# EAGLE design KeyCade (EAGLE 7.7.0)
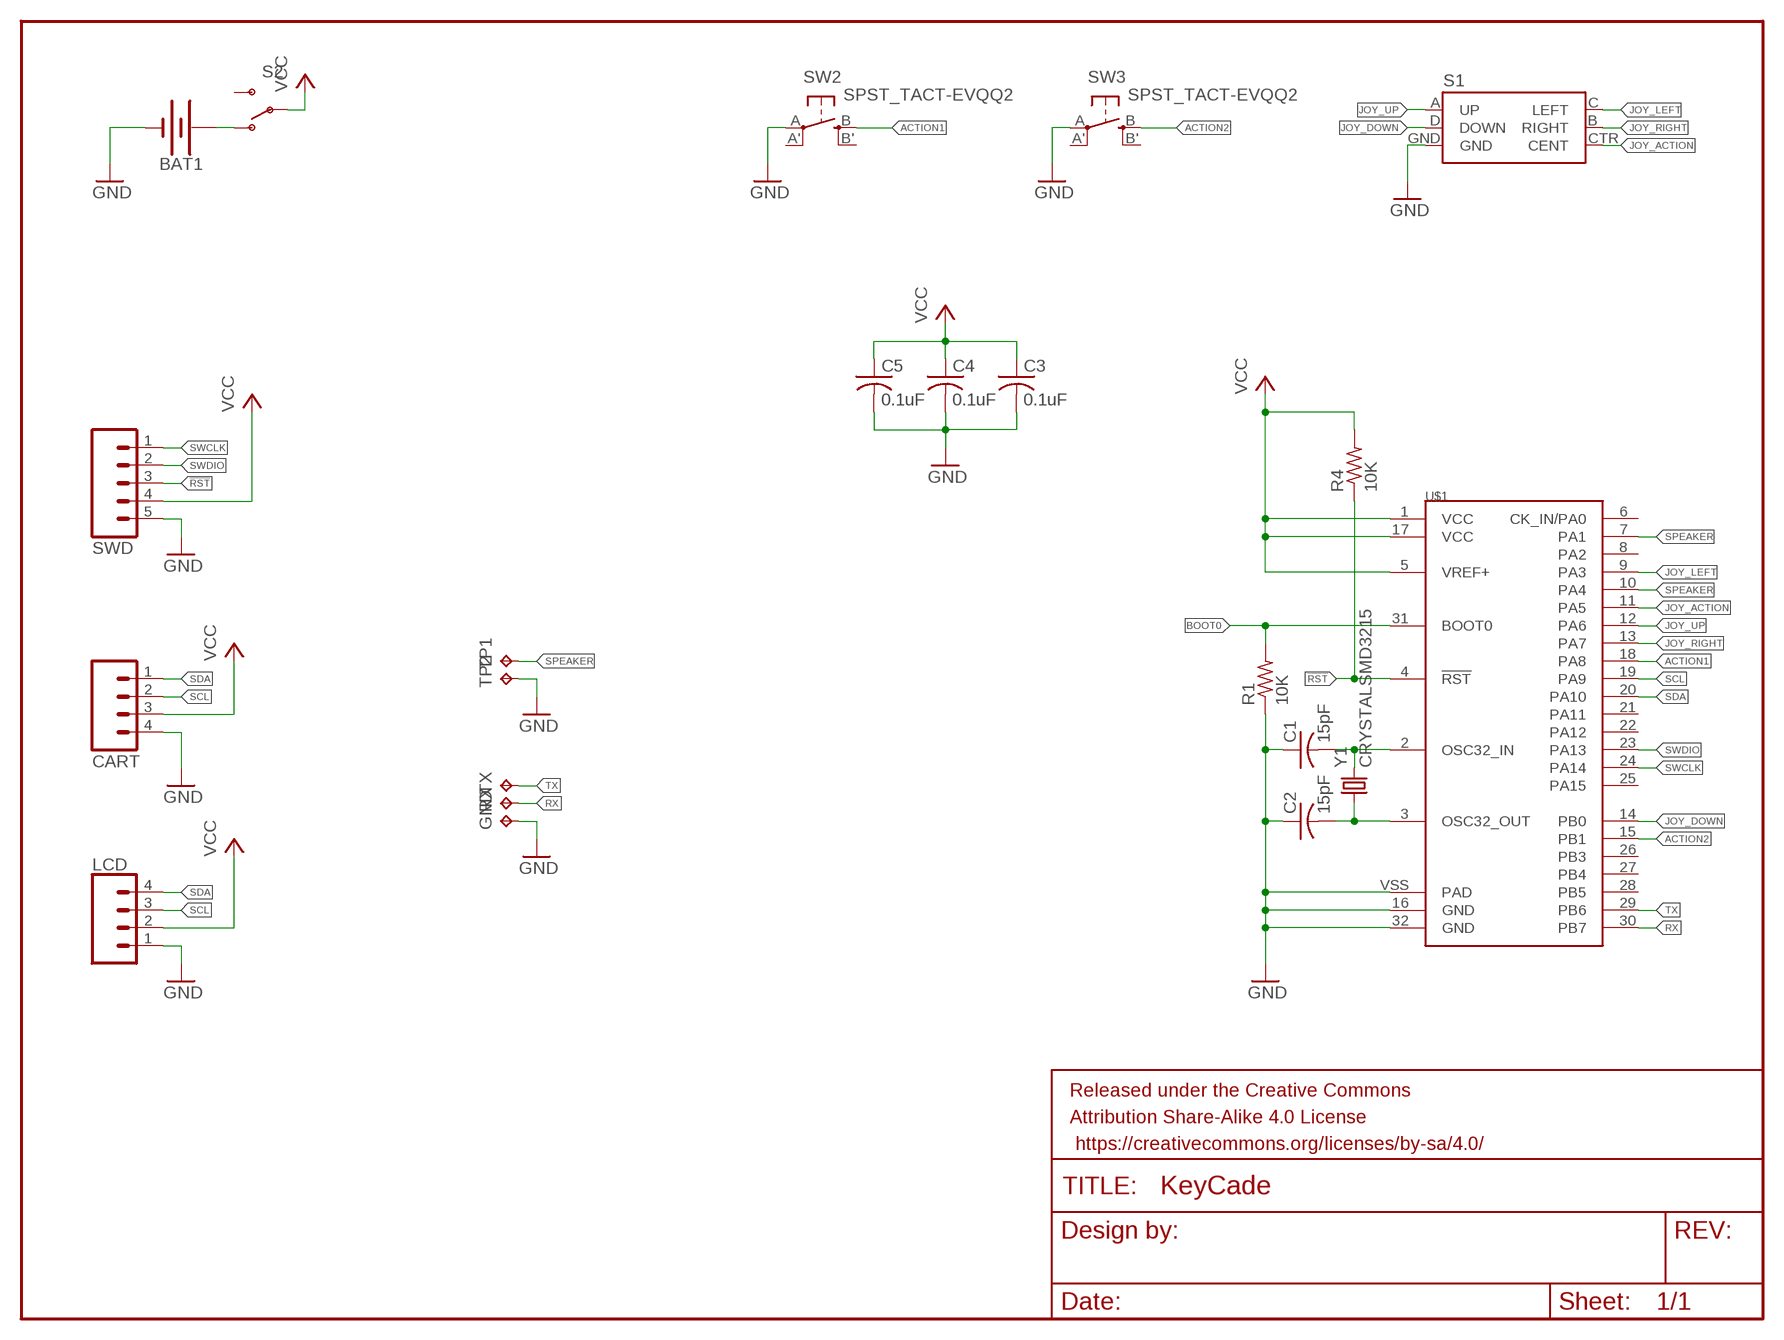
[diagram p0: schematic, sheet 1]

## Parts
BAT1  BATTERY-20MM_SMD_4LEGS  [BATTCON_20MM_4LEGS]
C1  15pF  C-USC0603  [C0603]
C2  15pF  C-USC0603  [C0603]
C3  0.1uF  C-USC0603  [C0603]
C4  0.1uF  C-USC0603  [C0603]
C5  0.1uF  C-USC0603  [C0603]
CART  M04PTH  [1X04@1]
FRAME1  FRAME-LETTER  [CREATIVE_COMMONS]
GND  TPTP17SQ  [TP17SQ]
LCD  CONN_04SMD_RA_FEMALE  [1X04_SMD_RA_FEMALE]
R1  10K  R-US_R0603  [R0603]
R4  10K  R-US_R0603  [R0603]
RX  TPTP17SQ  [TP17SQ]
S1  JOYSTICK_MINI  [JOYSTICK_MINI]
S2  SWITCH-SPDT-SMD-A  [SWITCH-SPST-SMD-A]
SW2  SPST_TACT-EVQQ2  [EVQ-Q2]
SW3  SPST_TACT-EVQQ2  [EVQ-Q2]
SWD  M05PTH  [1X05]
TP1  TPTP17SQ  [TP17SQ]
TP2  TPTP17SQ  [TP17SQ]
TX  TPTP17SQ  [TP17SQ]
U$1  STM32L432KCIC  [UFQFPN32]
Y1  CRYSTALSMD3215  [ST3215SB_32X15]

## Nets
!RST: R4.1 SWD.3 U$1.4(!RST)
+3V: BAT1.POSITIVE@1(+) BAT1.POSITIVE@2(+) BAT1.POSITIVE@3(+) BAT1.POSITIVE@4(+) S2.1(O)
ACTION1: SW2.B(S) U$1.18(PA8)
ACTION2: SW3.B(S) U$1.15(PB1)
BOOT0: R1.2 U$1.31(BOOT0)
GND: BAT1.NEGATIVE(-) C1.1 C2.1 C3.2 C4.2 C5.2 CART.4 GND.TP LCD.1 R1.1 S1.GND SW2.A(P) SW3.A(P) SWD.5 TP2.TP U$1.16(GND) U$1.32(GND) U$1.VSS(PAD)
JOY_ACTION: S1.CTR(CENT) U$1.11(PA5)
JOY_DOWN: S1.D(DOWN) U$1.14(PB0)
JOY_LEFT: S1.C(LEFT) U$1.9(PA3)
JOY_RIGHT: S1.B(RIGHT) U$1.13(PA7)
JOY_UP: S1.A(UP) U$1.12(PA6)
OSC32_IN: C1.2 U$1.2(OSC32_IN) Y1.2
OSC32_OUT: C2.2 U$1.3(OSC32_OUT) Y1.1
RX: RX.TP U$1.30(PB7)
SCL: CART.2 LCD.3 U$1.19(PA9)
SDA: CART.1 LCD.4 U$1.20(PA10)
SPEAKER: TP1.TP U$1.7(PA1) U$1.10(PA4)
SWCLK: SWD.1 U$1.24(PA14)
SWDIO: SWD.2 U$1.23(PA13)
TX: TX.TP U$1.29(PB6)
VCC: C3.1 C4.1 C5.1 CART.3 LCD.2 R4.2 S2.2(P) SWD.4 U$1.1(VCC) U$1.5(VREF+) U$1.17(VCC)
Unconnected: S2.3(S) SW2.A'(P1) SW2.B'(S1) SW3.A'(P1) SW3.B'(S1) U$1.6(CK_IN/PA0) U$1.8(PA2) U$1.21(PA11) U$1.22(PA12) U$1.25(PA15) U$1.26(PB3) U$1.27(PB4) U$1.28(PB5)

## Library data of the parts
BAT1 = SparkFun-Batteries:BATTERY: Battery - Single Cell A variety of battery chemistries, sizes, and footprints. Device List: 20MM_PTH - Coin Cell Battery Holder - 20mm (PTH) <https://www.sparkfun.com/products/783> 12MM_SMD - Coin Cell Battery Holder - 12mm (SMD) <https://www.sparkfun.com/products/10592> 12MM_PTH - Coin Cell Battery Holder - 12mm (PTH) <https://www.sparkfun.com/products/7948> 20MM_SMD - 20mm Coin Cell Battery Holder (SMD) (2 legs) Used on the Big Time Watch Kit <https://www.sparkfun.com/products/11734> 20MM_SMD_4LEGS - Coin Cell Battery Holder - 20mm (SMD) <https://www.sparkfun.com/products/11892> 20MM_SMD_4LEGS_OVERPASTE - Coin Cell Battery Holder - 20mm (SMD) <https://www.sparkfun.com/products/11892> (Over-paste on the legs) 24.5MM_PTH - Coin Cell Battery Holder - 24.5mm (PTH) <https://www.sparkfun.com/products/8863> 9V - 9V Battery Holder - PC Mount Used on the SparkFun SparkPunk Sound Kit <https://www.sparkfun.com/products/11177> and SparkFun SparkPunk Sequencer Kit <https://www.sparkfun.com/products/12707> 18650 - Battery Holder - 18650 (PTH) <https://www.sparkfun.com/products/13113> AA - Battery Holder - 1xAA (PTH) <https://www.sparkfun.com/products/7949> AAA - Battery Holder - 1xAAA (PTH) <https://www.sparkfun.com/products/12718> AA_KIT - Battery Holder - 1xAA (PTH) <https://www.sparkfun.com/products/7949> Special kit package - pads only have exposed copper on one side of the board. AAA_KIT - Battery Holder - 1xAAA (PTH) <https://www.sparkfun.com/products/12718> Special kit package - pads only have exposed copper on one side of the board.; PROD_ID: BATT-10373; SF_SKU: PRT-11892
C1-C5 = adafruit:C-US: CAPACITOR, American symbol
CART = SparkFun-Connectors:M04: Header 4 Standard 4-pin 0.1" header. Use with straight break away headers (SKU : PRT-00116), right angle break away headers (PRT-00553), swiss pins (PRT-00743), machine pins (PRT-00117), and female headers (PRT-00115). Molex polarized connector foot print use with SKU : PRT-08231 with associated crimp pins and housings. 1MM SMD Version SKU: PRT-10208
FRAME1 = StuffLabs:FRAME-LETTER: Schematic Frame Standard 8.5x11 US Letter frame
GND RX TP1 TP2 TX = testpad:TP: Test pad
LCD = SparkFun-Connectors:CONN_04: Multi connection point. Often used as Generic Header-pin footprint for 0.1 inch spaced/style header connections On any of the 0.1 inch spaced packages, you can populate with these: Break Away Headers - Straight <https://www.sparkfun.com/products/116> (PRT-00116) Break Away Male Headers - Right Angle <https://www.sparkfun.com/products/553> (PRT-00553) Female Headers <https://www.sparkfun.com/products/115> (PRT-00115) Break Away Headers - Machine Pin <https://www.sparkfun.com/products/117> (PRT-00117) Break Away Female Headers - Swiss Machine Pin <https://www.sparkfun.com/products/743> (PRT-00743) For SCREWTERMINALS and SPRING TERMINALS visit here: Screw Terimnals on SparkFun.com <https://www.sparkfun.com/search/results?term=Screw+Terminals> (5mm/3.5mm/2.54mm spacing) This device is also useful as a general connection point to wire up your design to another part of your project. Our various solder wires solder well into these plated through hole pads. Hook-Up Wire - Assortment (Stranded, 22 AWG) <https://www.sparkfun.com/products/11375> (PRT-11375) Hook-Up Wire - Assortment (Solid Core, 22 AWG) <https://www.sparkfun.com/products/11367> (PRT-11367) View the entire wire category on our website here <https://www.sparkfun.com/categories/141> Special notes: Molex polarized connector foot print use with SKU : PRT-08231 with associated crimp pins and housings. 1MM SMD Version SKU: PRT-10208
R1 R4 = adafruit:R-US_: RESISTOR, American symbol
S1 = SparkFun-Electromechanical:JOYSTICK_MINI: Small 5-way tactile joystick, COM-10063 4UCON SF303GJ26; PROD_ID: SWCH-09905
S2 = SparkFun-Electromechanical:SWITCH-SPDT: SPDT Switch Simple slide switch, Spark Fun Electronics SKU : COM-00102 DPDT SMT slide switch, AYZ0202, SWCH-08179
SW2 SW3 = adafruit:SPST_TACT: SMT 6mm switch, EVQQ2 series http://www.ladyada.net/library/eagle
SWD = SparkFun-Connectors:M05: Header 5 Standard 5-pin 0.1" header. Use with straight break away headers (SKU : PRT-00116), right angle break away headers (PRT-00553), swiss pins (PRT-00743), machine pins (PRT-00117), and female headers (PRT-00115). Molex polarized connector foot print use with SKU : PRT-08230 with associated crimp pins and housings.
U$1 = StuffLabs:STM32L432KC
Y1 = StuffLabs:CRYSTAL

## Board
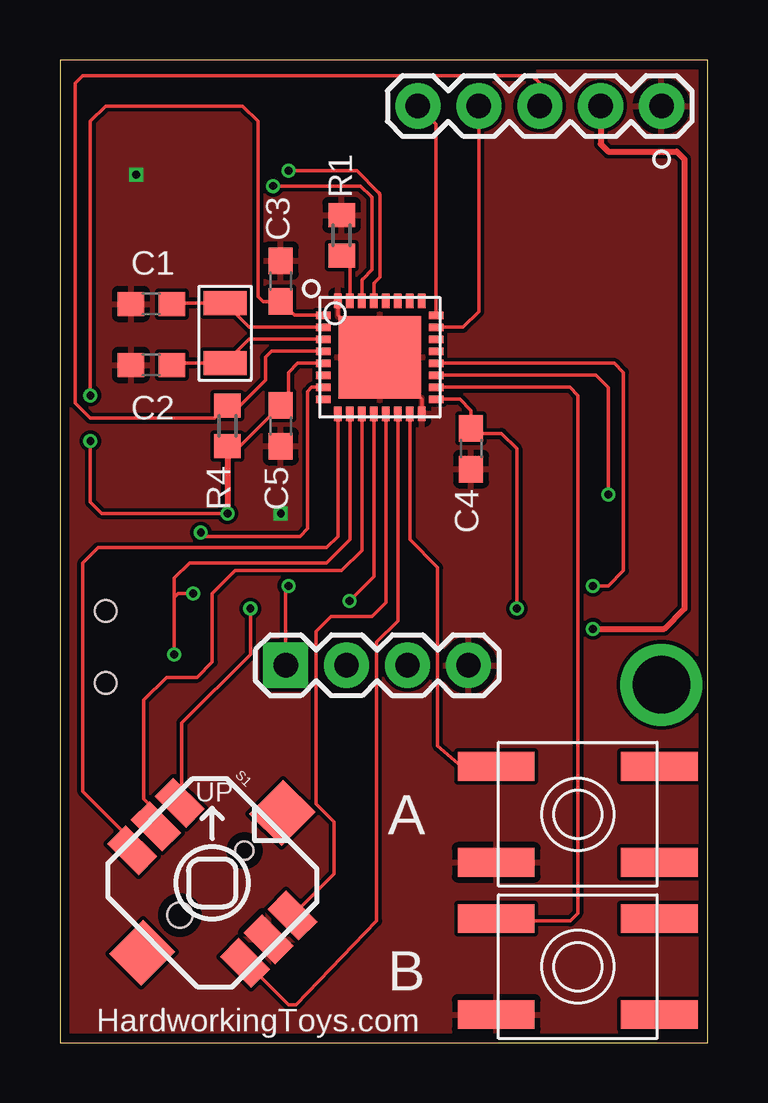
[diagram p1: board, top side]
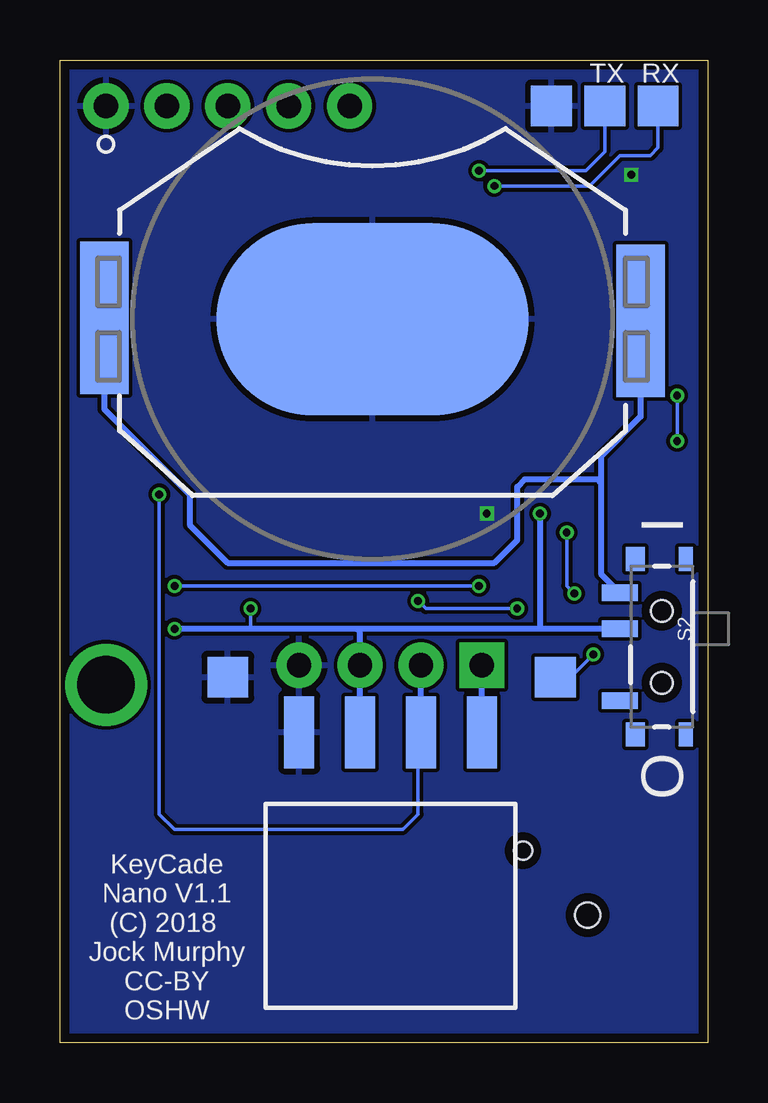
[diagram p2: board, bottom side, seen from below]

Size 27 x 40.97 mm. Coordinates in mm from the lower left corner, seen from the top.
Outline: 0,0 27,0 27,40.97 0,40.97 0,0
Copper layers (1*16): Top 0.035559375mm / dielectric 1.6mm / Bottom 0.035559375mm
Design rules "oshpark-2layer": minimum track width 6mil, minimum drill 10mil, track to track 6mil, track to pad 6mil, pad to pad 6mil, via to via 6mil, smd to smd 6mil, copper to edge 15mil, drill to drill 6mil, minimum pad ring 5mil, minimum via ring 5mil, stop-mask expansion 2.5mil, vias tented up to drill 0mil, thermal gap 10mil

### Footprints (pad centres in the part's own frame; a part is rotated, then mirrored left to right if it is on the bottom)
BATTCON_20MM_4LEGS = smd 13 x 8: NEGATIVE 0,0 | smd 2.032 x 3.175: POSITIVE@1 -11.176,1.651; POSITIVE@2 -11.176,-1.524; POSITIVE@3 11.176,1.524; POSITIVE@4 11.176,-1.651
C0603 = smd 1.1 x 1: 1 -0.85,0; 2 0.85,0
1X04@1 = drill 1.016 pad 1.88 square: 1 0,0 | drill 1.016 pad 1.88: 2 2.54,0; 3 5.08,0; 4 7.62,0
TP17SQ = smd 1.7 x 1.7: TP 0,0
1X04_SMD_RA_FEMALE = smd 1.25 x 3: 1 -3.81,7.225; 2 -1.27,7.225; 3 1.27,7.225; 4 3.81,7.225
R0603 = smd 1 x 1.1: 1 -0.85,0; 2 0.85,0
JOYSTICK_MINI = smd 1.85 x 1.1: A -3.325,1.4; B 3.325,1.4; C -3.325,-1.4; CTR -3.325,0; D 3.325,-1.4; GND 3.325,0 | smd 1.9 x 2: NC 0,4.13; NC@0 0,-4.13 | hole 0.75: 0,1.9 | hole 1.05: 0,-1.9
SWITCH-SPST-SMD-A = smd 0.7 x 1.5: 1 -2.25,-1.75; 2 -0.75,-1.75; 3 2.25,-1.75 | smd 1 x 0.6: GND1 -3.65,1; GND3 3.65,1 | smd 1 x 0.8: GND2 -3.65,-1.1; GND4 3.65,-1.1 | hole 0.9: -1.5,0; 1.5,0
EVQ-Q2 = smd 3.2 x 1.2: A -3.4,-2; A' 3.4,-2; B -3.4,2; B' 3.4,2
1X05 = drill 1.016 pad 1.88: 1 0,0; 2 2.54,0; 3 5.08,0; 4 7.62,0; 5 10.16,0
UFQFPN32 = smd 0.6 x 0.3: 1 -2.35,1.75; 2 -2.35,1.25; 3 -2.35,0.75; 4 -2.35,0.25; 5 -2.35,-0.25; 6 -2.35,-0.75; 7 -2.35,-1.25; 8 -2.35,-1.75; 17 2.35,-1.75; 18 2.35,-1.25; 19 2.35,-0.75; 20 2.35,-0.25; 21 2.35,0.25; 22 2.35,0.75; 23 2.35,1.25; 24 2.35,1.75 | smd 0.3 x 0.6: 9 -1.75,-2.35; 10 -1.25,-2.35; 11 -0.75,-2.35; 12 -0.25,-2.35; 13 0.25,-2.35; 14 0.75,-2.35; 15 1.25,-2.35; 16 1.75,-2.35; 25 1.75,2.35; 26 1.25,2.35; 27 0.75,2.35; 28 0.25,2.35; 29 -0.25,2.35; 30 -0.75,2.35; 31 -1.25,2.35; 32 -1.75,2.35 | smd 3.45 x 3.45: VSS 0,0
ST3215SB_32X15 = smd 1 x 1.8: 1 -1.2,0.1; 2 1.3,0.1

### Placement (x,y rotation side)
BAT1  13.97,30.16 180 bottom
C1  3.81,30.8 0 top
C2  3.81,28.26 0 top
C3  9.21,31.75 90 top
C4  17.14,24.77 270 top
C5  9.21,25.72 270 top
CART  9.41,15.74 0 top
FRAME1  13.34,-10.79 0 top  (outside the outline)
GND  6.51,39.05 0 bottom
LCD  13.22,5.71 0 bottom
R1  11.75,33.66 270 top
R4  6.99,25.72 270 top
RX  2.06,39.05 0 bottom
S1  6.35,6.67 315 top
S2  1.91,16.51 270 bottom
SW2  21.59,3.17 0 top
SW3  21.59,9.53 0 top
SWD  14.92,39.05 0 top
TP1  6.35,15.24 0 bottom
TP2  20,15.24 0 bottom
TX  4.29,39.05 0 bottom
U$1  13.34,28.57 0 top
Y1  6.99,29.53 90 top

### Tracks (layer width: path | path; a pad name or v marks a point on that pad's centre or on a via)
!RST
  Top 0.152: U$1.4 8.82,28.82 8.57,28.57 8.57,27.62 7.52,26.57 R4.1 6.45,26.04 1.27,26.04 0.64,26.67 0.64,40.01 0.95,40.32 19.68,40.32 20,40.01 SWD.3
+3V
  Bottom 0.254: 4.45,23.34 4.45,24.45 2.79,26.1 BAT1.POSITIVE@1 BAT1.POSITIVE@2 | 4.45,23.34 4.45,19.55 S2.1 | 25.08,31.88 BAT1.POSITIVE@4 BAT1.POSITIVE@3 25.15,26.42 21.59,22.86 21.59,21.59 20,20 8.89,20 7.94,20.95 7.94,23.18 7.62,23.5 4.6,23.5 4.45,23.34
ACTION1
  Top 0.152: U$1.18 21.25,27.32 21.59,26.99 21.59,5.4 21.27,5.08 17.02,5.08 SW2.B
ACTION2
  Top 0.152: U$1.15 14.59,20.98 15.75,19.81 15.75,12.38 16.73,11.53 SW3.B
BOOT0
  Top 0.152: U$1.31 12.09,32.47 R1.2
GND  (via drill 0.33)
  Top 0.152: U$1.32 11.59,30.32 U$1.VSS 15.09,26.82 U$1.16
  other vias: 3.17,36.2 9.21,22.07
  pour Top: 0,41.27 27.3,41.27 27.3,0 0,0
  pour Bottom: 0,41.27 27.3,41.27 27.3,0 0,0
JOY_ACTION
  Top 0.152: U$1.11 12.59,20.52 11.75,19.68 7.3,19.68 6.35,18.73 6.35,15.88 5.71,15.24 4.45,15.24 3.49,14.29 3.49,10.16 4,9.65 S1.CTR
JOY_DOWN
  Top 0.152: S1.D 7.71,3.27 7.62,3.17 7.94,3.17 9.53,1.59 9.84,1.59 13.21,5.08 13.21,16.7 14.09,17.58 U$1.14
JOY_LEFT
  Top 0.152: S1.C 3.01,8.42 0.95,10.48 0.95,20 1.59,20.64 11.11,20.64 11.59,21.11 U$1.9
JOY_RIGHT
  Top 0.152: U$1.13 13.59,18.35 13.02,17.78 11.3,17.78 10.67,17.14 10.67,9.97 11.43,9.21 11.43,7.04 S1.B
JOY_UP  (via drill 0.33)
  Top 0.152: U$1.12 13.09,19.43 v12.06,18.41 | S1.A 5.08,10.1 5.08,13.34 7.94,16.19 v7.94,18.1
  Bottom 0.152: v7.94,18.1 11.75,18.1 v12.06,18.41
N$2  (via drill 2.4)
  other vias: 25.08,14.92
OSC32_IN
  Top 0.152: U$1.2 7.89,29.82 Y1.2 4.69,30.83 C1.2
OSC32_OUT
  Top 0.152: U$1.3 7.88,29.32 Y1.1 4.73,28.33 C2.2
RX  (via drill 0.33)
  Top 0.152: U$1.30 12.59,31.73 arc-45 12.63,31.84 13.02,32.23 13.02,35.18 arc45 12.97,35.29 12.54,35.72 v8.89,35.72
  Bottom 0.152: RX.TP 2.06,37.31 2.38,36.99 3.65,36.99 4.92,35.72 v8.89,35.72
SCL  (via drill 0.33)
  Top 0.152: U$1.19 22.34,27.82 22.86,27.3 v22.86,22.86
  Bottom 0.152: v22.86,22.86 22.86,9.53 22.23,8.89 12.7,8.89 12.06,9.53 12.06,12.82 LCD.3
  Bottom 0.254: LCD.3 CART.2
SDA  (via drill 0.33)
  Top 0.152: U$1.20 23.11,28.32 23.5,27.94 23.5,19.68 22.86,19.05 v22.23,19.05 | CART.1 9.41,18.93 v9.53,19.05
  Bottom 0.152: v9.53,19.05 v22.23,19.05
  Bottom 0.254: LCD.4 CART.1
SPEAKER  (via drill 0.33)
  Top 0.152: U$1.10 12.09,20.98 11.11,20 5.4,20 4.76,19.37 4.76,18.57 | 4.76,18.57 v4.76,16.19 | v5.56,18.73 4.92,18.73 4.76,18.57 | U$1.7 10.5,27.32 10.32,27.15 10.32,21.43 10,21.11 6.03,21.11 v5.87,21.27
  Bottom 0.152: TP1.TP 5.71,15.24 v4.76,16.19 | v5.87,21.27 5.87,19.05 v5.56,18.73
SWCLK
  Top 0.152: U$1.24 15.69,38.29 SWD.1
SWDIO
  Top 0.152: U$1.23 16.81,29.82 17.46,30.48 SWD.2
TX  (via drill 0.33)
  Top 0.152: U$1.29 13.09,31.6 arc-45 13.13,31.7 13.34,31.91 13.34,35.34 arc45 13.29,35.45 12.38,36.35 v9.53,36.35
  Bottom 0.152: TX.TP 4.29,37.15 5.08,36.35 v9.53,36.35
VCC  (via drill 0.33)
  Top 0.152: U$1.5 9.91,28.32 9.53,27.94 9.53,26.89 C5.1 7.51,24.87 R4.2 | v19.05,18.1 19.05,24.77 18.41,25.4 17.14,25.4 C4.1 17.14,26.35 16.67,26.82 U$1.17 | v1.27,25.08 1.27,22.54 1.75,22.07 v6.99,22.07 | U$1.1 9.78,30.32 C3.1 8.47,30.9 8.26,31.11 8.26,38.42 7.62,39.05 1.91,39.05 1.27,38.42 v1.27,26.99
  Top 0.254: SWD.4 22.54,37.47 22.86,37.15 25.72,37.15 26.04,36.83 26.04,18.1 25.2,17.26 v22.23,17.26 | R4.2 v6.99,22.07
  Bottom 0.152: v19.05,18.1 19.05,17.26 | v1.27,26.99 v1.27,25.08
  Bottom 0.254: v6.99,22.07 6.99,17.26 | S2.2 6.99,17.26 | 6.99,17.26 14.61,17.26 | 14.61,17.26 19.05,17.26 v22.23,17.26 | LCD.2 CART.3 14.49,17.14 14.61,17.26

### Text on the board
tNames: A | B | HardworkingToys.com
bNames: I | O | KeyCade / Nano V1.1 / (C) 2018 / Jock Murphy / CC-BY / OSHW